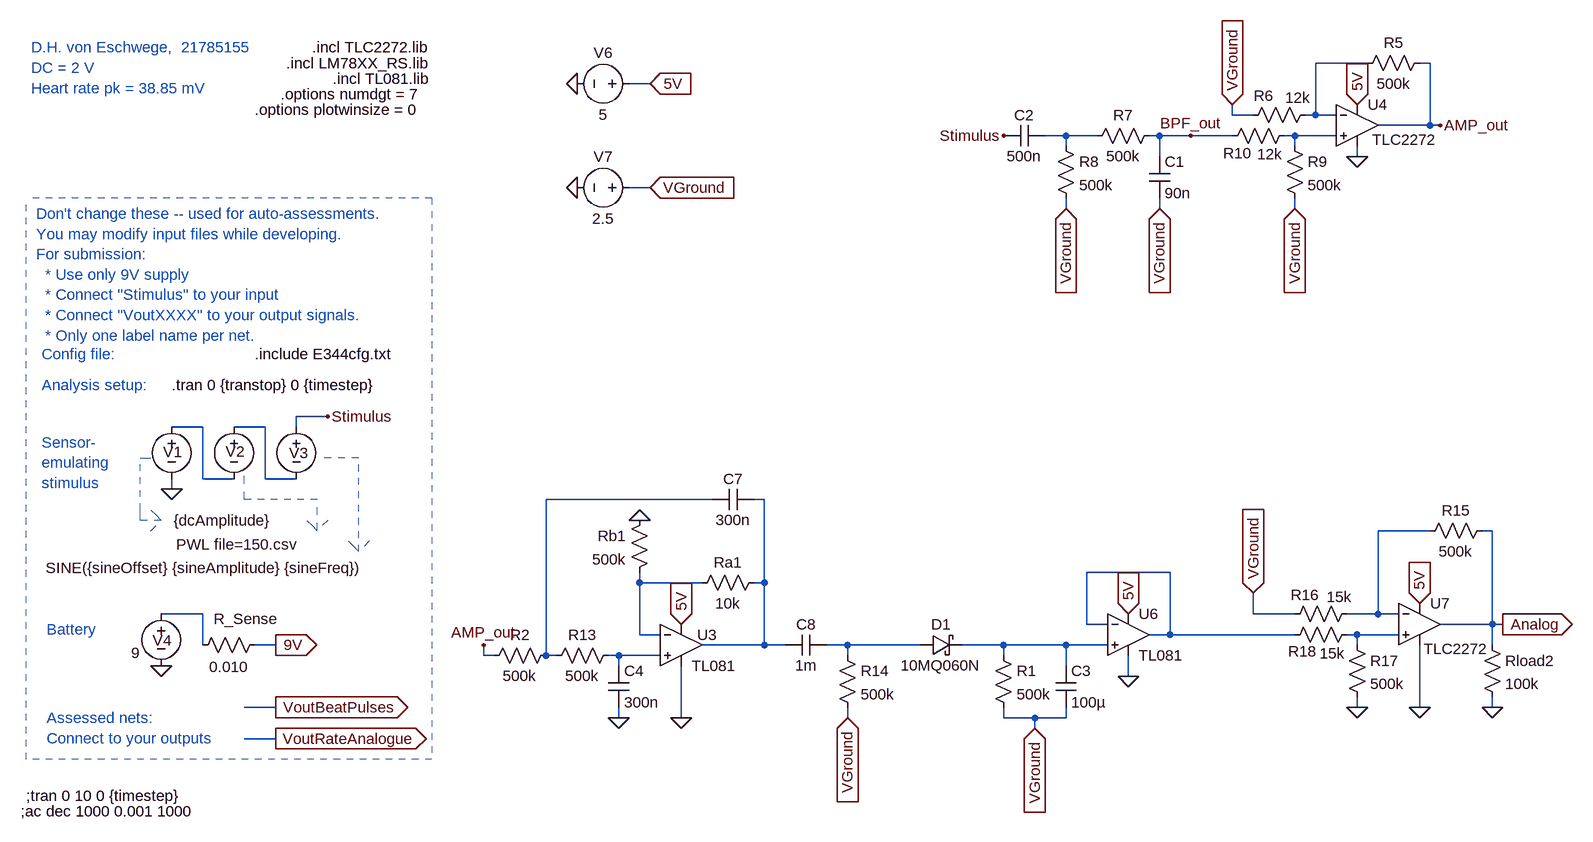
[diagram p0: schematic X_2ndOrderBPF_Schmitt_Bruh_FilteredSquare.asc]
X_2ndOrderBPF_Schmitt_Bruh_FilteredSquare.asc, the LTspice schematic file:
Version 4
SHEET 1 1824 680
WIRE -240 -1616 -320 -1616
WIRE -144 -1616 -160 -1616
WIRE -1344 -1584 -1376 -1584
WIRE -448 -1536 -448 -1552
WIRE -416 -1536 -448 -1536
WIRE -320 -1536 -320 -1616
WIRE -320 -1536 -336 -1536
WIRE -288 -1536 -320 -1536
WIRE -144 -1520 -144 -1616
WIRE -144 -1520 -224 -1520
WIRE -128 -1520 -144 -1520
WIRE -704 -1504 -736 -1504
WIRE -656 -1504 -704 -1504
WIRE -560 -1504 -576 -1504
WIRE -512 -1504 -560 -1504
WIRE -448 -1504 -512 -1504
WIRE -352 -1504 -368 -1504
WIRE -288 -1504 -352 -1504
WIRE -704 -1488 -704 -1504
WIRE -352 -1488 -352 -1504
WIRE -560 -1472 -560 -1504
WIRE -256 -1472 -256 -1488
WIRE -1344 -1424 -1376 -1424
WIRE -704 -1392 -704 -1408
WIRE -560 -1392 -560 -1408
WIRE -352 -1392 -352 -1408
WIRE -1840 -1072 -1888 -1072
WIRE -2032 -1056 -2080 -1056
WIRE -1936 -1056 -1984 -1056
WIRE -1888 -1056 -1888 -1072
WIRE -2032 -976 -2032 -1056
WIRE -1984 -976 -2032 -976
WIRE -1936 -976 -1936 -1056
WIRE -1888 -976 -1936 -976
WIRE -2080 -960 -2080 -976
WIRE -1248 -944 -1504 -944
WIRE -1168 -944 -1184 -944
WIRE -144 -896 -224 -896
WIRE -48 -896 -64 -896
WIRE -544 -832 -672 -832
WIRE -1360 -816 -1360 -832
WIRE -1264 -816 -1360 -816
WIRE -1168 -816 -1168 -944
WIRE -1168 -816 -1184 -816
WIRE -2032 -768 -2096 -768
WIRE -416 -768 -416 -800
WIRE -352 -768 -416 -768
WIRE -224 -768 -224 -896
WIRE -224 -768 -272 -768
WIRE -192 -768 -224 -768
WIRE -672 -752 -672 -832
WIRE -640 -752 -672 -752
WIRE -48 -752 -48 -896
WIRE -48 -752 -128 -752
WIRE -32 -752 -48 -752
WIRE -1360 -736 -1360 -816
WIRE -1328 -736 -1360 -736
WIRE -544 -736 -544 -832
WIRE -544 -736 -576 -736
WIRE -352 -736 -544 -736
WIRE -256 -736 -272 -736
WIRE -192 -736 -256 -736
WIRE -2032 -720 -2032 -768
WIRE -1920 -720 -1952 -720
WIRE -1168 -720 -1168 -816
WIRE -1168 -720 -1264 -720
WIRE -1136 -720 -1168 -720
WIRE -1040 -720 -1072 -720
WIRE -928 -720 -1040 -720
WIRE -800 -720 -864 -720
WIRE -704 -720 -800 -720
WIRE -640 -720 -704 -720
WIRE -256 -720 -256 -736
WIRE -48 -720 -48 -752
WIRE -1600 -704 -1600 -720
WIRE -1584 -704 -1600 -704
WIRE -1504 -704 -1504 -944
WIRE -1488 -704 -1504 -704
WIRE -1392 -704 -1408 -704
WIRE -1328 -704 -1392 -704
WIRE -1040 -704 -1040 -720
WIRE -800 -704 -800 -720
WIRE -1392 -688 -1392 -704
WIRE -704 -688 -704 -720
WIRE -608 -672 -608 -704
WIRE -1920 -624 -1968 -624
WIRE -256 -624 -256 -640
WIRE -160 -624 -160 -720
WIRE -48 -624 -48 -640
WIRE -1392 -608 -1392 -624
WIRE -1296 -608 -1296 -688
WIRE -1040 -608 -1040 -624
WIRE -800 -608 -800 -624
WIRE -752 -608 -800 -608
WIRE -704 -608 -704 -624
WIRE -704 -608 -752 -608
WIRE -752 -592 -752 -608
WIRE -1920 -576 -1968 -576
FLAG -2080 -960 0
FLAG -1840 -1072 Stimulus
FLAG -1920 -720 9V
IOPIN -1920 -720 Out
FLAG -2096 -688 0
FLAG -1920 -624 VoutBeatPulses
IOPIN -1920 -624 Out
FLAG -1920 -576 VoutRateAnalogue
IOPIN -1920 -576 Out
FLAG -1344 -1584 5V
IOPIN -1344 -1584 In
FLAG -256 -1472 0
FLAG -512 -1504 BPF_out
FLAG -256 -1552 5V
IOPIN -256 -1552 In
FLAG -800 -1504 Stimulus
FLAG -704 -1392 VGround
IOPIN -704 -1392 In
FLAG -560 -1392 VGround
IOPIN -560 -1392 In
FLAG -352 -1392 VGround
IOPIN -352 -1392 In
FLAG -448 -1552 VGround
IOPIN -448 -1552 In
FLAG -1600 -720 AMP_out
FLAG -1296 -608 0
FLAG -1392 -608 0
FLAG -1360 -912 0
FLAG -1296 -752 5V
IOPIN -1296 -752 In
FLAG -128 -1520 AMP_out
FLAG -1040 -608 VGround
IOPIN -1040 -608 In
FLAG -752 -592 VGround
IOPIN -752 -592 In
FLAG -608 -672 0
FLAG -608 -768 5V
IOPIN -608 -768 In
FLAG -32 -752 Analog
IOPIN -32 -752 Out
FLAG -48 -624 0
FLAG -160 -624 0
FLAG -256 -624 0
FLAG -160 -784 5V
IOPIN -160 -784 In
FLAG -1456 -1584 0
FLAG -1456 -1424 0
FLAG -1344 -1424 VGround
IOPIN -1344 -1424 In
FLAG -416 -800 VGround
IOPIN -416 -800 In
SYMBOL voltage -1984 -1072 R0
WINDOW 123 0 0 Left 0
WINDOW 39 0 0 Left 0
WINDOW 3 -89 197 Left 2
WINDOW 0 -13 54 Left 2
SYMATTR Value PWL file=150.csv
SYMATTR InstName V2
SYMBOL voltage -1888 -1072 R0
WINDOW 123 24 44 Left 2
WINDOW 39 0 0 Left 0
WINDOW 3 -386 233 Left 2
WINDOW 0 -11 56 Left 2
SYMATTR Value SINE({sineOffset} {sineAmplitude} {sineFreq})
SYMATTR InstName V3
SYMBOL voltage -2080 -1072 R0
WINDOW 123 0 0 Left 0
WINDOW 39 0 0 Left 0
WINDOW 3 3 160 Left 2
WINDOW 0 -13 55 Left 2
SYMATTR Value {dcAmplitude}
SYMATTR InstName V1
SYMBOL voltage -2096 -784 R0
WINDOW 123 24 44 Left 2
WINDOW 39 0 0 Left 0
WINDOW 3 -46 76 Left 2
WINDOW 0 -13 57 Left 2
SYMATTR Value 9
SYMATTR InstName V4
SYMBOL res -1936 -736 R90
WINDOW 0 -9 30 VBottom 2
WINDOW 3 34 56 VTop 2
SYMATTR InstName R_Sense
SYMATTR Value 0.010
SYMBOL res -144 -1632 R90
WINDOW 0 0 56 VBottom 2
WINDOW 3 32 56 VTop 2
SYMATTR InstName R5
SYMATTR Value 500k
SYMBOL res -320 -1552 R90
WINDOW 0 2 80 VBottom 2
WINDOW 3 -26 27 VTop 2
SYMATTR InstName R6
SYMATTR Value 12k
SYMBOL Opamps\\opamp2 -256 -1584 R0
WINDOW 3 23 86 Left 2
SYMATTR Value TLC2272
SYMATTR InstName U4
SYMBOL res -368 -1504 R0
SYMATTR InstName R9
SYMATTR Value 500k
SYMBOL res -352 -1520 R90
WINDOW 0 58 88 VBottom 2
WINDOW 3 29 38 VTop 2
SYMATTR InstName R10
SYMATTR Value 12k
SYMBOL res -560 -1520 R90
WINDOW 0 0 56 VBottom 2
WINDOW 3 32 56 VTop 2
SYMATTR InstName R7
SYMATTR Value 500k
SYMBOL cap -576 -1472 R0
SYMATTR InstName C1
SYMATTR Value 90n
SYMBOL cap -736 -1488 M270
WINDOW 0 32 32 VTop 2
WINDOW 3 0 32 VBottom 2
SYMATTR InstName C2
SYMATTR Value 500n
SYMBOL res -720 -1504 R0
SYMATTR InstName R8
SYMATTR Value 500k
SYMBOL res -1488 -720 R90
WINDOW 0 0 56 VBottom 2
WINDOW 3 32 56 VTop 2
SYMATTR InstName R2
SYMATTR Value 500k
SYMBOL cap -1408 -688 R0
SYMATTR InstName C4
SYMATTR Value 300n
SYMBOL Opamps\\opamp2 -1296 -784 R0
WINDOW 0 25 48 Left 2
SYMATTR InstName U3
SYMATTR Value TL081
SYMBOL res -1392 -720 R90
WINDOW 0 0 56 VBottom 2
WINDOW 3 32 56 VTop 2
SYMATTR InstName R13
SYMATTR Value 500k
SYMBOL res -1168 -832 R90
WINDOW 0 0 56 VBottom 2
WINDOW 3 32 56 VTop 2
SYMATTR InstName Ra1
SYMATTR Value 10k
SYMBOL res -1344 -928 M0
SYMATTR InstName Rb1
SYMATTR Value 500k
SYMBOL cap -1184 -960 R90
WINDOW 0 0 32 VBottom 2
WINDOW 3 32 32 VTop 2
SYMATTR InstName C7
SYMATTR Value 300n
SYMBOL schottky -928 -704 R270
WINDOW 0 32 32 VTop 2
WINDOW 3 0 32 VBottom 2
SYMATTR InstName D1
SYMATTR Value 10MQ060N
SYMATTR Description Diode
SYMATTR Type diode
SYMBOL res -816 -720 R0
SYMATTR InstName R1
SYMATTR Value 500k
SYMBOL cap -720 -688 R0
SYMATTR InstName C3
SYMATTR Value 100µ
SYMBOL cap -1072 -736 R90
WINDOW 0 0 32 VBottom 2
WINDOW 3 32 32 VTop 2
SYMATTR InstName C8
SYMATTR Value 1m
SYMBOL res -1056 -720 R0
SYMATTR InstName R14
SYMATTR Value 500k
SYMBOL Opamps\\opamp2 -608 -800 R0
SYMATTR InstName U6
SYMATTR Value TL081
SYMBOL res -64 -736 R0
SYMATTR InstName Rload2
SYMATTR Value 100k
SYMBOL res -48 -912 R90
WINDOW 0 0 56 VBottom 2
WINDOW 3 32 56 VTop 2
SYMATTR InstName R15
SYMATTR Value 500k
SYMBOL res -256 -784 R90
WINDOW 0 2 80 VBottom 2
WINDOW 3 -26 27 VTop 2
SYMATTR InstName R16
SYMATTR Value 15k
SYMBOL Opamps\\opamp2 -160 -816 R0
WINDOW 3 6 102 Left 2
SYMATTR Value TLC2272
SYMATTR InstName U7
SYMBOL res -272 -736 R0
SYMATTR InstName R17
SYMATTR Value 500k
SYMBOL res -256 -752 R90
WINDOW 0 57 84 VBottom 2
WINDOW 3 29 38 VTop 2
SYMATTR InstName R18
SYMATTR Value 15k
SYMBOL voltage -1360 -1584 R90
WINDOW 0 -32 56 VBottom 2
WINDOW 3 32 56 VTop 2
WINDOW 123 0 0 Left 0
WINDOW 39 0 0 Left 0
SYMATTR InstName V6
SYMATTR Value 5
SYMBOL voltage -1360 -1424 R90
WINDOW 0 -32 56 VBottom 2
WINDOW 3 32 56 VTop 2
WINDOW 123 0 0 Left 0
WINDOW 39 0 0 Left 0
SYMATTR InstName V7
SYMATTR Value 2.5
TEXT -2080 -1120 Left 2 !.tran 0 {transtop} 0 {timestep}
TEXT -1952 -1168 Left 2 !.include E344cfg.txt
TEXT -2288 -1384 Left 2 ;Don't change these -- used for auto-assessments.\nYou may modify input files while developing.\nFor submission: \n  * Use only 9V supply \n  * Connect "Stimulus" to your input\n  * Connect "VoutXXXX" to your output signals.\n  * Only one label name per net.
TEXT -2280 -1168 Left 2 ;Config file:
TEXT -2280 -1120 Left 2 ;Analysis setup:
TEXT -2272 -744 Left 2 ;Battery
TEXT -2280 -1032 Left 2 ;Sensor-\nemulating \nstimulus
TEXT -2272 -608 Left 2 ;Assessed nets:\nConnect to your outputs
TEXT -2296 -1640 Left 2 ;D.H. von Eschwege,  21785155\nDC = 2 V\nHeart rate pk = 38.85 mV
TEXT -1864 -1640 Left 2 !.incl TLC2272.lib
TEXT -1904 -1616 Left 2 !.incl LM78XX_RS.lib
TEXT -1832 -1592 Left 2 !.incl TL081.lib
TEXT -1912 -1568 Left 2 !.options numdgt = 7
TEXT -1952 -1544 Left 2 !.options plotwinsize = 0
TEXT -2312 -464 Left 2 !;ac dec 1000 0.001 1000
TEXT -2304 -488 Left 2 !;tran 0 10 0 {timestep}
LINE Normal -1792 -1008 -1856 -1008 2
LINE Normal -1792 -864 -1792 -1008 2
LINE Normal -1808 -880 -1792 -864 2
LINE Normal -1792 -864 -1808 -880 2
LINE Normal -1776 -880 -1792 -864 2
LINE Normal -2128 -1008 -2112 -1008 2
LINE Normal -2128 -928 -2128 -1008 2
LINE Normal -2128 -912 -2128 -928 2
LINE Normal -2096 -912 -2128 -912 2
LINE Normal -2112 -928 -2096 -912 2
LINE Normal -2096 -912 -2112 -928 2
LINE Normal -2112 -896 -2096 -912 2
LINE Normal -1968 -944 -1968 -992 2
LINE Normal -1856 -944 -1968 -944 2
LINE Normal -1856 -896 -1856 -944 2
LINE Normal -1872 -912 -1856 -896 2
LINE Normal -1856 -896 -1872 -912 2
LINE Normal -1840 -912 -1856 -896 2
LINE Normal -2304 -544 -2304 -1408 1
LINE Normal -1680 -1408 -1680 -544 1
LINE Normal -1680 -544 -2304 -544 1
LINE Normal -1680 -1408 -2304 -1408 1

The netlist it stands for:
* X_2ndOrderBPF_Schmitt_Bruh_FilteredSquare.asc
V2 N005 N004 PWL file=150.csv
V3 Stimulus N005 SINE({sineOffset} {sineAmplitude} {sineFreq})
V1 N004 0 {dcAmplitude}
V4 N011 0 9
R_Sense 9V N011 0.010
R5 AMP_out N001 500k
R6 N001 VGround 12k
XU4 N003 N001 5V 0 AMP_out TLC2272  ; pins In+ In- V+ V- OUT
R9 N003 VGround 500k
R10 N003 BPF_out 12k
R7 BPF_out N002 500k
C1 BPF_out VGround 90n
C2 N002 Stimulus 500n
R8 N002 VGround 500k
R2 N006 AMP_out 500k
C4 N015 0 300n
XU3 N015 N010 5V 0 N007 TL081  ; pins In+ In- V+ V- OUT
R13 N015 N006 500k
Ra1 N007 N010 10k
Rb1 0 N010 500k
C7 N007 N006 300n
D1 N013 N014 10MQ060N
R1 N014 VGround 500k
C3 N014 VGround 100µ
C8 N013 N007 1m
R14 N013 VGround 500k
XU6 N014 N009 5V 0 N009 TL081  ; pins In+ In- V+ V- OUT
Rload2 Analog 0 100k
R15 Analog N008 500k
R16 N008 VGround 15k
XU7 N012 N008 5V 0 Analog TLC2272  ; pins In+ In- V+ V- OUT
R17 N012 0 500k
R18 N012 N009 15k
V6 5V 0 5
V7 VGround 0 2.5
.model D D
.lib standard.dio
.tran 0 {transtop} 0 {timestep}
.include E344cfg.txt
* Don't change these -- used for auto-assessments.
* You may modify input files while developing.
* For submission:
*   * Use only 9V supply
*   * Connect "Stimulus" to your input
*   * Connect "VoutXXXX" to your output signals.
*   * Only one label name per net.
* Config file:
* Analysis setup:
* Battery
* Sensor-
* emulating
* stimulus
* Assessed nets:
* Connect to your outputs
* D.H. von Eschwege,  21785155
* DC = 2 V
* Heart rate pk = 38.85 mV
.incl TLC2272.lib
.incl LM78XX_RS.lib
.incl TL081.lib
.options numdgt = 7
.options plotwinsize = 0
;ac dec 1000 0.001 1000
;tran 0 10 0 {timestep}
.backanno
.end